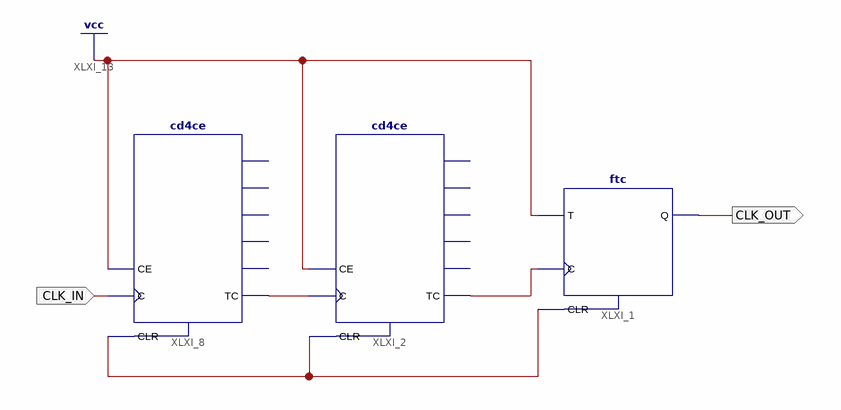
[diagram p0: schematic sheet 1]
// Xilinx ISE schematic DIV_200.sch (spartan6) as structural Verilog: 3 symbols, 2 ports
module DIV_200 (
  input  CLK_IN,
  output CLK_OUT
);

  wire XLXN_3, XLXN_4, XLXN_9;

  ftc XLXI_1 (.C(XLXN_3), .CLR(XLXN_9), .T(1'b1), .Q(CLK_OUT));
  cd4ce XLXI_2 (.C(XLXN_4), .CE(1'b1), .CLR(XLXN_9), .TC(XLXN_3));  // open: CEO, Q0, Q1, Q2, Q3
  cd4ce XLXI_8 (.C(CLK_IN), .CE(1'b1), .CLR(XLXN_9), .TC(XLXN_4));  // open: CEO, Q0, Q1, Q2, Q3
endmodule
